# EAGLE design Controller (EAGLE 9.6.2)
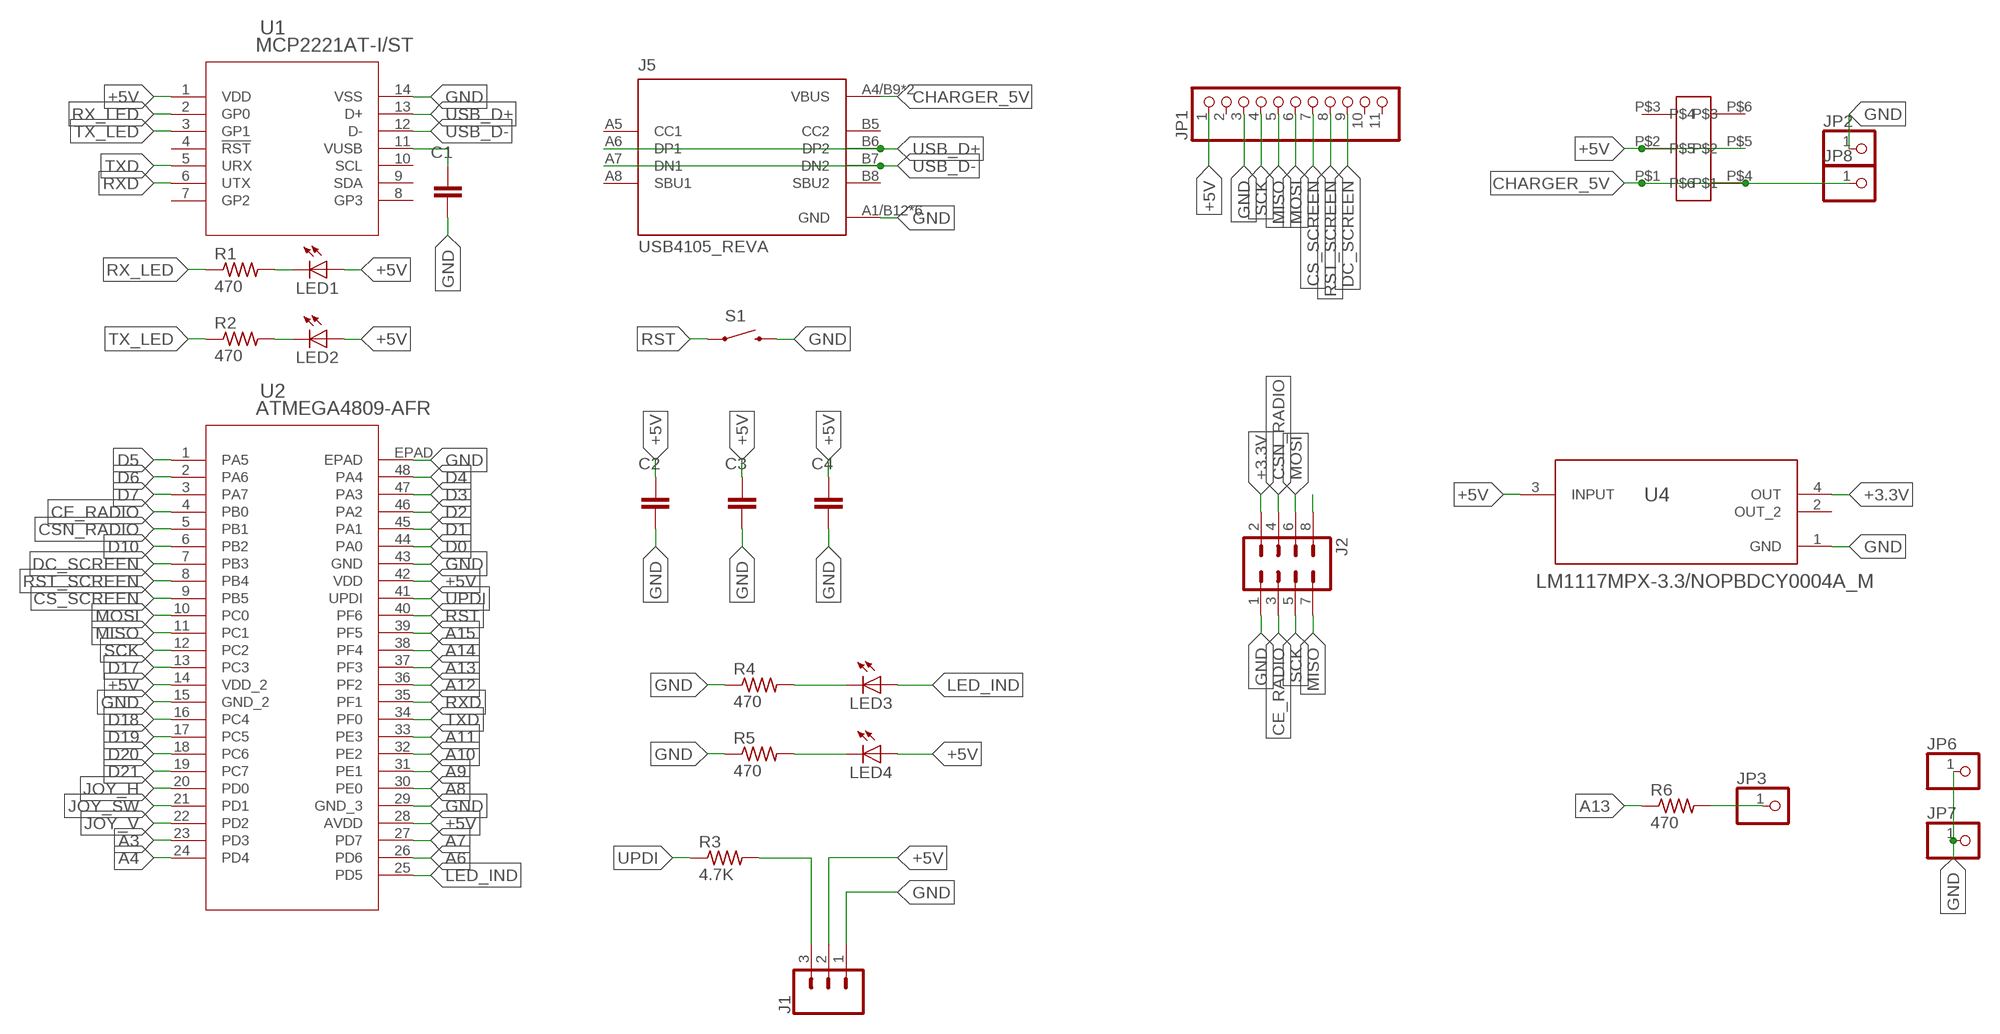
[diagram p0: schematic, sheet 1]

## Parts
C1  0.22uF  CC0805KRX7R9BB104  [CAP_0805]
C2  0.1uF  CC0805KRX7R9BB104  [CAP_0805]
C3  0.1uF  CC0805KRX7R9BB104  [CAP_0805]
C4  0.1uF  CC0805KRX7R9BB104  [CAP_0805]
J1  CONN_03SMD_RA_MALE  [1X03_SMD_RA_MALE]
J2  MA04-2  [MA04-2]
J5  USB4105_REVA  [GCT_USB4105_REVA]
JP1  PINHD-1X11  [1X11]
JP2  PINHD-1X1  [1X01]
JP3  PINHD-1X1  [1X01]
JP6  PINHD-1X1  [1X01]
JP7  PINHD-1X1  [1X01]
JP8  PINHD-1X1  [1X01]
LED1  LEDCHIPLED_0805  [CHIPLED_0805]
LED2  LEDCHIPLED_0805  [CHIPLED_0805]
LED3  LEDCHIPLED_0805  [CHIPLED_0805]
LED4  LEDCHIPLED_0805  [CHIPLED_0805]
R1  470  R-US_R0805  [R0805]
R2  470  R-US_R0805  [R0805]
R3  4.7K  R-US_R0805  [R0805]
R4  470  R-US_R0805  [R0805]
R5  470  R-US_R0805  [R0805]
R6  470  R-US_R0805  [R0805]
S1  RS032G05A3SM-SPST-MOMENTARY-SWSMD-1101NE  [TACTILE-SWITCH-1101NE]
U1  MCP2221AT-I/ST  [TSSOP14_ST_MCH]
U2  ATMEGA4809-AFR  [TQFP48_7X7MC_MCH]
U4  LM1117MPX-3.3/NOPBDCY0004A_M  [DCY0004A_M]
U$47  JS202011JAQN  [JS202011JAQN]

## Nets
+3.3V: J2.2 U4.4(OUT)
+5V: C2.1 C3.1 C4.1 J1.2 JP1.1 LED1.A LED2.A LED4.A U1.1(VDD) U2.14(VDD_2) U2.28(AVDD) U2.42(VDD) U4.3(INPUT) U$47.P$2 U$47.P$5
A3: U2.23(PD3)
A4: U2.24(PD4)
A6: U2.26(PD6)
A7: U2.27(PD7)
A8: U2.30(PE0)
A9: U2.31(PE1)
A10: U2.32(PE2)
A11: U2.33(PE3)
A12: U2.36(PF2)
A13: R6.1 U2.37(PF3)
A14: U2.38(PF4)
A15: U2.39(PF5)
CE_RADIO: J2.3 U2.4(PB0)
CHARGER_5V: J5.A4/B9(VBUS) J5.B4/A9(VBUS) JP8.1 U$47.P$1 U$47.P$4
CS_SCREEN: JP1.7 U2.9(PB5)
CSN_RADIO: J2.4 U2.5(PB1)
D0: U2.44(PA0)
D1: U2.45(PA1)
D2: U2.46(PA2)
D3: U2.47(PA3)
D4: U2.48(PA4)
D5: U2.1(PA5)
D6: U2.2(PA6)
D7: U2.3(PA7)
D10: U2.6(PB2)
D17: U2.13(PC3)
D18: U2.16(PC4)
D19: U2.17(PC5)
D20: U2.18(PC6)
D21: U2.19(PC7)
DC_SCREEN: JP1.9 U2.7(PB3)
GND: C1.2 C2.2 C3.2 C4.2 J1.1 J2.1 J5.A1/B12(GND) J5.B1/A12(GND) J5.G1(GND) J5.G2(GND) J5.G3(GND) J5.G4(GND) JP1.3 JP2.1 JP6.1 JP7.1 R4.1 R5.1 S1.2 U1.14(VSS) U2.15(GND_2) U2.29(GND_3) U2.43(GND) U2.EPAD U4.1(GND)
JOY_H: U2.20(PD0)
JOY_SW: U2.21(PD1)
JOY_V: U2.22(PD2)
LED_IND: LED3.A U2.25(PD5)
MISO: J2.7 JP1.5 U2.11(PC1)
MOSI: J2.6 JP1.6 U2.10(PC0)
N$3: LED1.C R1.2
N$5: LED2.C R2.2
N$6: J2.8
N$7: C1.1 U1.11(VUSB)
N$10: JP3.1 R6.2
N$12: LED3.C R4.2
N$13: LED4.C R5.2
N$14: J1.3 R3.2
RST: S1.1 U2.40(PF6)
RST_SCREEN: JP1.8 U2.8(PB4)
RX_LED: R1.1 U1.2(GP0)
RXD: U1.6(UTX) U2.35(PF1)
SCK: J2.5 JP1.4 U2.12(PC2)
TX_LED: R2.1 U1.3(GP1)
TXD: U1.5(URX) U2.34(PF0)
UPDI: R3.1 U2.41(UPDI)
USB_D+: J5.A6(DP1) J5.B6(DP2) U1.13(D+)
USB_D-: J5.A7(DN1) J5.B7(DN2) U1.12(D-)
Unconnected: J5.A5(CC1) J5.A8(SBU1) J5.B5(CC2) J5.B8(SBU2) JP1.2 JP1.10 JP1.11 U1.4(!RST) U1.7(GP2) U1.8(GP3) U1.9(SDA) U1.10(SCL) U$47.P$3 U$47.P$6

## Power pins joined to a net without a drawn wire
OUT_2: U4.2(OUT_2)

## Library data of the parts
C1-C4 = Resistor_Capacitor:CC0805KRX7R9BB104: CAP CER 0.1UF 50V X7R 0805 Manufacturer's datasheet <http://www.yageo.com/documents/recent/UPY-GPHC_X7R_6.3V-to-50V_18.pdf>; CREATED_BY: PCBLayout.com; DIGIKEY_PART_NUMBER: 311-1140-2-ND; MANUFACTURER: Yageo; MPN: CC0805KRX7R9BB104; PACKAGE: SMD 0805
J1 = SparkFun-Connectors:CONN_03: Multi connection point. Often used as Generic Header-pin footprint for 0.1 inch spaced/style header connections On any of the 0.1 inch spaced packages, you can populate with these: Break Away Headers - Straight <https://www.sparkfun.com/products/116> (PRT-00116) Break Away Male Headers - Right Angle <https://www.sparkfun.com/products/553> (PRT-00553) Female Headers <https://www.sparkfun.com/products/115> (PRT-00115) Break Away Headers - Machine Pin <https://www.sparkfun.com/products/117> (PRT-00117) Break Away Female Headers - Swiss Machine Pin <https://www.sparkfun.com/products/743> (PRT-00743) Stackable Header - 3 Pin (Female, 0.1") <https://www.sparkfun.com/products/13875> (PRT-13875) For SCREWTERMINALS and SPRING TERMINALS visit here: Screw Terimnals on SparkFun.com <https://www.sparkfun.com/search/results?term=Screw+Terminals> (5mm/3.5mm/2.54mm spacing) This device is also useful as a general connection point to wire up your design to another part of your project. Our various solder wires solder well into these plated through hole pads. Hook-Up Wire - Assortment (Stranded, 22 AWG) <https://www.sparkfun.com/products/11375> (PRT-11375) Hook-Up Wire - Assortment (Solid Core, 22 AWG) <https://www.sparkfun.com/products/11367> (PRT-11367) View the entire wire category on our website here <https://www.sparkfun.com/categories/141> Special notes: Molex polarized connector foot print use with SKU : PRT-08232 with associated crimp pins and housings.; PROD_ID: CONN-10925
J2 = con-lstb:MA04-2: PIN HEADER; OC_FARNELL: unknown; OC_NEWARK: unknown
J5 = USB4105_REVA:USB4105_REVA: USB Type C Receptacle for USB 2.0 SMT Type, PCB Top Mount; DESCRIPTION: USB-C (USB TYPE-C) USB 2.0 Receptacle Connector 24 (16+8 Dummy) Position Surface Mount, Right Angle; Through Hole; MF: Global Connector Technology; MP: USB4105; PACKAGE: Package
JP1 = pinhead:PINHD-1X11: PIN HEADER
JP2 JP3 JP6-JP8 = pinhead:PINHD-1X1: PIN HEADER
LED1-LED4 = adafruit:LED: LED OSRAM: - CHIPLED LG R971, LG N971, LY N971, LG Q971, LY Q971, LO R971, LY R971 LH N974, LH R974 LS Q976, LO Q976, LY Q976 LO Q996 - Hyper CHIPLED LW Q18S LB Q993, LB Q99A, LB R99A - SideLED LS A670, LO A670, LY A670, LG A670, LP A670 LB A673, LV A673, LT A673, LW A673 LH A674 LY A675 LS A676, LA A676, LO A676, LY A676, LW A676 LS A679, LY A679, LG A679 - Hyper Micro SIDELED® LS Y876, LA Y876, LO Y876, LY Y876 LT Y87S - SmartLED LW L88C, LW L88S LB L89C, LB L89S, LG L890 LS L89K, LO L89K, LY L89K LS L896, LA L896, LO L896, LY L896 - TOPLED LS T670, LO T670, LY T670, LG T670, LP T670 LSG T670, LSP T670, LSY T670, LOP T670, LYG T670 LG T671, LOG T671, LSG T671 LB T673, LV T673, LT T673, LW T673 LH T674 LS T676, LA T676, LO T676, LY T676, LB T676, LH T676, LSB T676, LW T676 LB T67C, LV T67C, LT T67C, LS T67K, LO T67K, LY T67K, LW E67C LS E67B, LA E67B, LO E67B, LY E67B, LB E67C, LV E67C, LT E67C LW T67C LS T679, LY T679, LG T679 LS T770, LO T770, LY T770, LG T770, LP T770 LB T773, LV T773, LT T773, LW T773 LH T774 LS E675, LA E675, LY E675, LS T675 LS T776, LA T776, LO T776, LY T776, LB T776 LHGB T686 LT T68C, LB T68C - Hyper Mini TOPLED® LB M676 - Mini TOPLED Santana® LG M470 LS M47K, LO M47K, LY M47K Source: http://www.osram.convergy.de/
R1-R6 = audio amplifier example:R-US_: RESISTOR, American symbol
S1 = BeagleBone_Blue_R3:RS032G05A3SM-SPST-MOMENTARY-SW: 6x3.5mm 2-pin Momentary Switch (Push-button) Digikey Link <https://www.digikey.com/products/en?keywords=CKN10388TR-ND> Datasheet <https://media.digikey.com/pdf/Data%20Sheets/C&K/RS-032G05_-SM_RT.pdf>; PROD_ID: SWCH-00815
U1 = LillyLib:MCP2221AT-I/ST; BUILT_BY: EMA_Cory; COPYRIGHT: Copyright (C) 2018 Accelerated Designs. All rights reserved; DATASHEET: https://ww1.microchip.com/downloads/en/DeviceDoc/20005565C.pdf; MANUFACTURER_PART_NUMBER: MCP2221AT-I/ST; SOURCELIBRARY: Add_to_database_2021-02-23; VENDOR: Microchip
U2 = ATMEGA4809:ATMEGA4809-AFR; BUILT_BY: EMA_Jessica; COPYRIGHT: Copyright (C) 2018 Accelerated Designs. All rights reserved; MANUFACTURER_PART_NUMBER: ATMEGA4809-AFR; SOURCELIBRARY: Microchip_2019-12-30; VENDOR: Microchip
U4 = SkateboardLib:LM1117MPX-3.3/NOPB; COPYRIGHT: Copyright (C) 2022 Ultra Librarian. All rights reserved.; MANUFACTURER_PART_NUMBER: LM1117MPX-3.3/NOPB; MFR_NAME: Texas Instruments; REFDES: RefDes; TYPE: TYPE
U$47 = SMD Slide Switch:JS202011JAQN

## Board
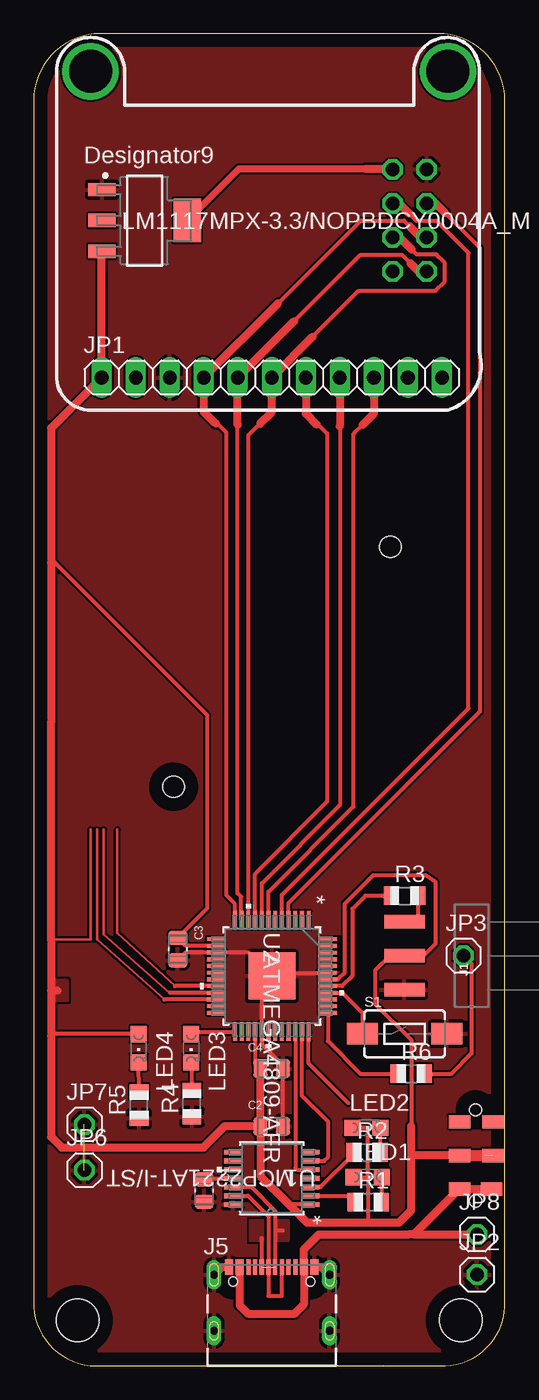
[diagram p1: board, top side]
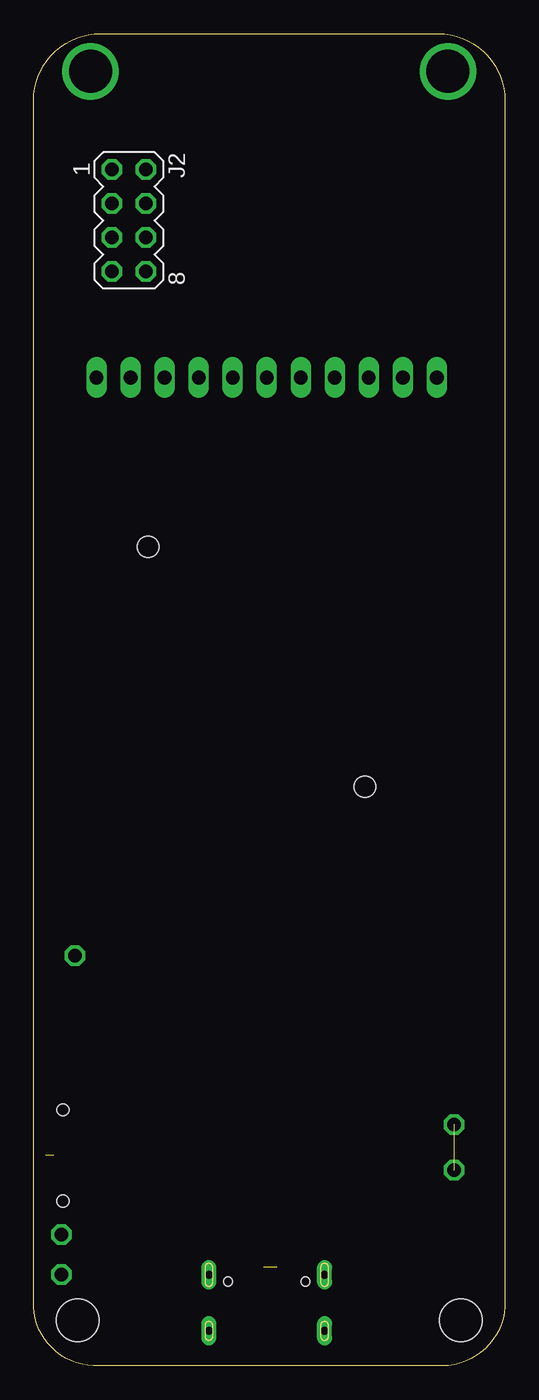
[diagram p2: board, bottom side, seen from below]

Size 35.2 x 99.41 mm. Coordinates in mm from the lower left corner, seen from the top.
Outline: 0,94.41 0,4.41 arc90 5.1,0.01 30.3,0.01 arc90 35.2,4.41 35.2,94.41 arc90 30.2,99.41 5,99.41 arc90 0,94.41
Copper layers (1*16): Top 0.035mm / dielectric 1.5mm / Bottom 0.035mm
Design rules "default": minimum track width 6mil, minimum drill 0.35mm, track to track 6mil, track to pad 6mil, pad to pad 6mil, via to via 6mil, smd to smd 6mil, copper to edge 40mil, drill to drill 6mil, minimum pad ring 10mil, minimum via ring 8mil, stop-mask expansion 4mil, vias tented up to drill 0mil, thermal gap 10mil
Holes 3.2 mm at 3.3,3.41 31.9,3.41
Holes 1.6 mm at 26.65,61.11 10.45,43.21

### Footprints (pad centres in the part's own frame; a part is rotated, then mirrored left to right if it is on the bottom)
CAP_0805 = smd 1.05 x 1.38: 1 -0.84,0; 2 0.84,0
1X03_SMD_RA_MALE = smd 1 x 3: 1 -2.54,5; 2 0,5; 3 2.54,5
MA04-2 = drill 1.016 octagon: 1 -3.81,-1.27; 2 -3.81,1.27; 3 -1.27,-1.27; 4 -1.27,1.27; 5 1.27,-1.27; 6 1.27,1.27; 7 3.81,-1.27; 8 3.81,1.27
GCT_USB4105_REVA = smd 0.6 x 1.15: A1/B12 -3.2,4.755; A4/B9 -2.4,4.755; B1/A12 3.2,4.755; B4/A9 2.4,4.755 | smd 0.3 x 1.15: A5 -1.25,4.755; A6 -0.25,4.755; A7 0.25,4.755; A8 1.25,4.755; B5 1.75,4.755; B6 0.75,4.755; B7 -0.75,4.755; B8 -1.75,4.755 | drill 0.6 pad 1 long: G1 -4.32,0; G2 4.32,0 | drill 0.6 pad 1.05 long: G3 -4.32,4.18; G4 4.32,4.18 | hole 0.65: 2.89,3.68; -2.89,3.68
1X11 = drill 1.016 long: 1 -12.7,0; 2 -10.16,0; 3 -7.62,0; 4 -5.08,0; 5 -2.54,0; 6 0,0; 7 2.54,0; 8 5.08,0; 9 7.62,0; 10 10.16,0; 11 12.7,0
1X01 = drill 1.016 octagon: 1 0,0
CHIPLED_0805 = smd 1.2 x 1.2: A 0,-1.05; C 0,1.05
R0805 = smd 1.1 x 1.4: 1 -1,0; 2 1,0
TACTILE-SWITCH-1101NE = smd 2.3 x 1.6: 1 -3.15,0; 2 3.15,0
TSSOP14_ST_MCH = smd 1.302 x 0.355: 1 -2.899,1.95; 2 -2.899,1.3; 3 -2.899,0.65; 4 -2.899,0; 5 -2.899,-0.65; 6 -2.899,-1.3; 7 -2.899,-1.95; 8 2.899,-1.95; 9 2.899,-1.3; 10 2.899,-0.65; 11 2.899,0; 12 2.899,0.65; 13 2.899,1.3; 14 2.899,1.95
TQFP48_7X7MC_MCH = smd 1.341 x 0.279: 1 -4.176,2.75; 2 -4.176,2.25; 3 -4.176,1.75; 4 -4.176,1.25; 5 -4.176,0.75; 6 -4.176,0.25; 7 -4.176,-0.25; 8 -4.176,-0.75; 9 -4.176,-1.25; 10 -4.176,-1.75; 11 -4.176,-2.25; 12 -4.176,-2.75; 25 4.176,-2.75; 26 4.176,-2.25; 27 4.176,-1.75; 28 4.176,-1.25; 29 4.176,-0.75; 30 4.176,-0.25; 31 4.176,0.25; 32 4.176,0.75; 33 4.176,1.25; 34 4.176,1.75; 35 4.176,2.25; 36 4.176,2.75 | smd 0.279 x 1.341: 13 -2.75,-4.176; 14 -2.25,-4.176; 15 -1.75,-4.176; 16 -1.25,-4.176; 17 -0.75,-4.176; 18 -0.25,-4.176; 19 0.25,-4.176; 20 0.75,-4.176; 21 1.25,-4.176; 22 1.75,-4.176; 23 2.25,-4.176; 24 2.75,-4.176; 37 2.75,4.176; 38 2.25,4.176; 39 1.75,4.176; 40 1.25,4.176; 41 0.75,4.176; 42 0.25,4.176; 43 -0.25,4.176; 44 -0.75,4.176; 45 -1.25,4.176; 46 -1.75,4.176; 47 -2.25,4.176; 48 -2.75,4.176 | smd 3.505 x 3.505: EPAD 0,0
DCY0004A_M = smd 2.05 x 1: 1 -3.175,2.3; 2 -3.175,0; 3 -3.175,-2.3 | smd 2.05 x 3.25: 4 3.175,0
JS202011JAQN = smd 1 x 1.6: P$1 0,0; P$2 2.5,0; P$3 5,0; P$4 0,-2.4; P$5 2.5,-2.5; P$6 5,-2.5 | hole 0.9: -0.9,-1.2; 5.9,-1.2

### Placement (x,y rotation side)
C1  12.73,13.08 270 top
C2  17.79,17.88 0 top
C3  10.77,31.1 270 top
C4  17.79,22.18 0 top
J1  32.7,30.61 90 top
J2  28.08,85.46 270 bottom
J5  17.79,2.62 0 top
JP1  17.79,73.74 0 top
JP2  33.1,6.81 0 top
JP3  32.1,30.61 0 top
JP6  3.8,14.61 0 top
JP7  3.8,18.01 0 top
JP8  33.1,9.81 0 top
LED1  24.95,14.09 270 top
LED2  24.85,17.77 270 top
LED3  11.77,23.71 180 top
LED4  7.85,23.71 180 top
R1  24.99,12.23 0 top
R2  24.91,15.93 0 top
R3  27.71,35.08 0 top
R4  11.82,19.58 90 top
R5  7.88,19.46 90 top
R6  28.2,21.81 0 top
S1  27.7,24.78 0 top
U1  17.79,14 180 top
U2  17.79,29.09 270 top
U4  8.3,85.46 0 top
U$47  31.8,13.21 90 top

### Tracks (layer width: path | path; a pad name or v marks a point on that pad's centre or on a via)
+3.3V
  Top 0.508: U4.4 15.32,89.31 24.8,89.31 25.1,89.31
  Top 0.61: 24.8,89.31 26.77,89.31 J2.2
+5V  (1 unrouted)
  Top 0.2: 1.32,31.81 4.25,31.81 4.25,40.01
  Top 0.305: U2.42 22.71,28.84 23.24,29.38 23.24,34.5 25.35,36.61 29.27,36.61 30.03,36.11 30.03,31.54 29.1,30.61 J1.2 26.6,30.61 25.5,29.51 25.5,27.01 28.2,24.31 28.2,17.91 | U2.28 16.54,22.53 C4.1 16.66,22.41 | U2.14 11.37,31.34 C3.1 12.97,34.14 12.97,48.56 1.62,59.91 1.32,59.91 | LED2.A 24.96,17.77 24.96,14.11 | 24.96,14.11 24.95,14.09 LED1.A | LED4.A 1.47,24.76 1.32,24.61 | 1.25,48.08 1.32,48.01 | U1.1 19.06,12.05 18.95,12.16 | 24.9,10.71 24.96,10.78 24.96,14.11
  Top 0.61: C2.1 14.27,17.88 12.7,16.31 2.1,16.31 1.32,17.09 1.32,24.61 1.32,28.01 | 1.32,28.01 1.32,31.81 1.32,48.01 1.32,59.91 1.32,69.97 JP1.1 5.09,83.13 U4.3 | C2.1 C4.1 | C2.1 16.95,14.16 18.95,12.16 20.4,10.71 24.9,10.71 27.3,10.71 28.2,11.61 28.2,15.71 | 1.32,28.01 1.8,28.01 | 28.2,15.71 28.2,17.91 | U$47.P$2 28.2,15.71
  Top 0.813: U$47.P$2 33.68,15.71
  pour Top: 1.2,28.71 1.2,27.31 2.5,27.31 2.5,28.71
A12
  Top 0.305: U2.36 20.54,22.57 23.5,19.61
A13
  Top 0.305: U2.37 21.96,24.25 24.4,21.81 R6.1
CE_RADIO
  Top 0.305: U2.4 19.04,34.55 33.32,48.83 33.32,83.43 30.72,86.03
  Top 0.61: 30.72,86.03 30.02,86.73 J2.3
CHARGER_5V
  Top 0.61: J5.A4/B9 15.39,4.52 16,3.91 19.5,3.91 20.19,4.6 J5.B4/A9 20.19,8.7 21.3,9.81 28,9.81 28.4,9.81 | U$47.P$4 U$47.P$1 28.4,9.81 | 28.4,9.81 JP8.1
CS_SCREEN
  Top 0.305: U2.9 16.54,36.71 21.91,42.13 21.91,69.56 21.13,70.34 21.13,70.24
  Top 0.61: JP1.7 20.33,71.04 21.13,70.24
CSN_RADIO
  Top 0.305: U2.5 18.54,35.15 32.46,49.07 32.46,83.05 30.1,85.41 28.63,85.41 28.07,85.98
  Top 0.61: J2.4 27.31,86.73 28.07,85.98
DC_SCREEN
  Top 0.305: U2.7 17.54,35.37 23.9,41.73 23.9,69.55 24.58,70.23
  Top 0.61: 24.58,70.23 25.41,71.06 JP1.9
GND  (1 unrouted)
  Top 0.305: C1.2 12.92,12.05 | U2.EPAD 18.04,29.34 U2.43 | U2.EPAD 16.04,30.84 U2.15 11.35,30.84 C3.2 | U2.EPAD 17.04,28.34 U2.29 17.04,24.01 18.57,22.48 C4.2 C2.2
  Top 0.61: J5.A1/B12 14.04,7.38 J5.G3 | J5.G4 21.54,7.38 J5.B1/A12
  pour Top (rank 2): 30.8,0.01 4.4,0.01 arc-90 0,4.41 0,94.41 arc-90 5,99.41 30.2,99.41 arc-90 35.2,94.41 35.2,4.41 arc-90
JOY_H
  Top 0.2: 10.57,28.34 6.25,32.31 6.25,40.01
  Top 0.305: U2.20 10.57,28.34
JOY_SW
  Top 0.2: 10.17,27.84 5.25,32.21 5.25,40.01
  Top 0.305: U2.21 10.17,27.84
JOY_V
  Top 0.2: 9.77,27.34 4.75,31.81 4.75,40.01
  Top 0.305: U2.22 9.77,27.34
LED_IND
  Top 0.305: LED3.A 11.93,24.92 U2.25
MISO
  Top 0.305: U2.11 15.5,33.27 15.5,35.03 15.25,35.27 15.25,70.21 | 19.46,77.95 24.42,82.91 27.5,82.91 28.15,82.26
  Top 0.61: 15.25,70.21 JP1.5 19.46,77.95 | J2.7 28.76,81.65 28.15,82.26
MOSI
  Top 0.305: U2.10 16.04,69.44 16.91,70.3 | 20.83,76.78 24.26,80.21 30,80.21 30.7,80.91 30.7,82.31 30.09,82.93 28.61,82.93 28.21,83.32
  Top 0.61: 16.91,70.3 17.8,71.18 JP1.6 20.83,76.78 | J2.6 27.34,84.19 28.21,83.32
N$1  (via drill 3.2)
  other vias: 30.93,96.59
N$2  (via drill 3.2)
  other vias: 4.26,96.59
N$3
  Top 0.305: R1.2 LED1.C
N$5
  Top 0.305: R2.2 LED2.C
N$7
  Top 0.305: C1.1 12.74,14 U1.11
N$10
  Top 0.305: JP3.1 32.7,30.01 32.7,23.31 31.2,21.81 R6.2
N$12
  Top 0.305: R4.2 11.82,22.66 LED3.C
N$13
  Top 0.305: R5.2 LED4.C
N$14
  Top 0.305: J1.3 28.71,33.15 R3.2
RST
  Top 0.305: U2.40 23.07,27.84 24.55,26.36 S1.1
RST_SCREEN
  Top 0.305: U2.8 17.04,36.01 22.87,41.84 22.87,70.11
  Top 0.61: JP1.8 22.87,70.11
RX_LED
  Top 0.305: U1.2 23.52,12.7 R1.1
RXD
  Top 0.305: U1.6 21.69,15.3 22,15.61 22,18.21 20.04,20.17 U2.35
SCK
  Top 0.305: U2.12 15.04,34.47 14.4,35.11 14.4,69.65 13.74,70.31 13.6,70.31 | JP1.4 | 28.1,85.01 27.65,85.46 24.43,85.46 18.24,79.27
  Top 0.61: 18.24,79.27 JP1.4 12.71,71.2 13.6,70.31 | J2.5 28.92,84.19 28.1,85.01
TX_LED
  Top 0.305: U1.3 21.44,13.35 23.91,15.82 R2.1
TXD
  Top 0.305: 19.58,24.87 U2.34 19.54,14.77 19.66,14.65 U1.5
UPDI
  Top 0.305: R3.1 24.77,35.08 23.8,34.11 23.8,29.11 23.03,28.34 U2.41
USB_D+
  Top 0.305: U1.13 16.01,12.7 17.54,11.17 J5.A6 17.54,5.21 18.54,5.21 J5.B6
USB_D-  (1 unrouted)
  Top 0.305: U1.12 16.26,13.35 18.04,11.57 18.04,10.11 | 18.04,10.11 J5.A7 | J5.B7 17.04,9.54 | 18.04,10.11 18.6,10.11
  pour Top: 16.2,10.81 16.2,9.41 17.1,9.41 17.1,10.81
  pour Top: 18.1,10.81 18.1,9.41 19,9.41 19,10.81